# EAGLE design uwbsender (EAGLE 8.6.0)
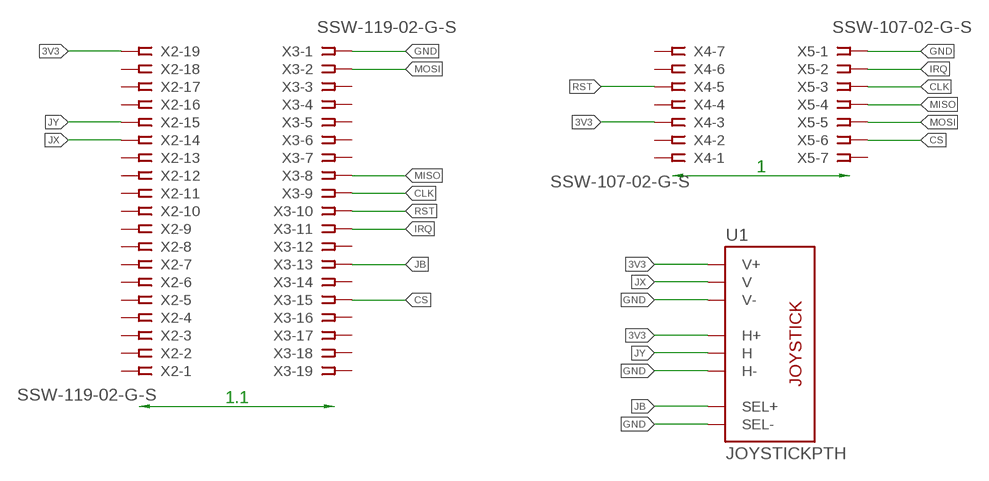
[diagram p0: schematic, sheet 1]

## Parts
U1  JOYSTICKPTH  [JOYSTICK]
X2  SSW-119-02-G-S  [SSW-119-02-G-S]
X3  SSW-119-02-G-S  [SSW-119-02-G-S]
X4  SSW-107-02-G-S  [SSW-107-02-G-S]
X5  SSW-107-02-G-S  [SSW-107-02-G-S]

## Nets
3V3: U1.H1(H+) U1.V1(V+) X2.19 X4.3
CLK: X3.9 X5.3
CS: X3.15 X5.6
GND: U1.B2A(SEL-) U1.H3(H-) U1.V3(V-) X3.1 X5.1
IRQ: X3.11 X5.2
JB: U1.B1A(SEL+) X3.13
JX: U1.V2(V) X2.14
JY: U1.H2(H) X2.15
MISO: X3.8 X5.4
MOSI: X3.2 X5.5
RST: X3.10 X4.5
Unconnected: X2.1 X2.2 X2.3 X2.4 X2.5 X2.6 X2.7 X2.8 X2.9 X2.10 X2.11 X2.12 X2.13 X2.16 X2.17 X2.18 X3.3 X3.4 X3.5 X3.6 X3.7 X3.12 X3.14 X3.16 X3.17 X3.18 X3.19 X4.1 X4.2 X4.4 X4.6 X4.7 X5.7

## Library data of the parts
U1 = adafruit:JOYSTICK: Thumb Joystick Joystick commonly found in PS2 controllers. Two pots and a select switch. Adapted from Sparkfun Library (but for more common 6mm switch sticks)
X2 X3 = con-samtec:SSW-119-02-G-S: THROUGH-HOLE .025" SQ POST SOCKET Source: Samtec SSW.pdf; MF: Samtec Inc.; MPN: SSW-119-02-G-S; OC_FARNELL: unknown; OC_NEWARK: 11P9625
X4 X5 = con-samtec:SSW-107-02-G-S: THROUGH-HOLE .025" SQ POST SOCKET Source: Samtec SSW.pdf; MF: Samtec Inc.; MPN: SSW-107-02-G-S; OC_FARNELL: unknown; OC_NEWARK: 11P9433

## Board
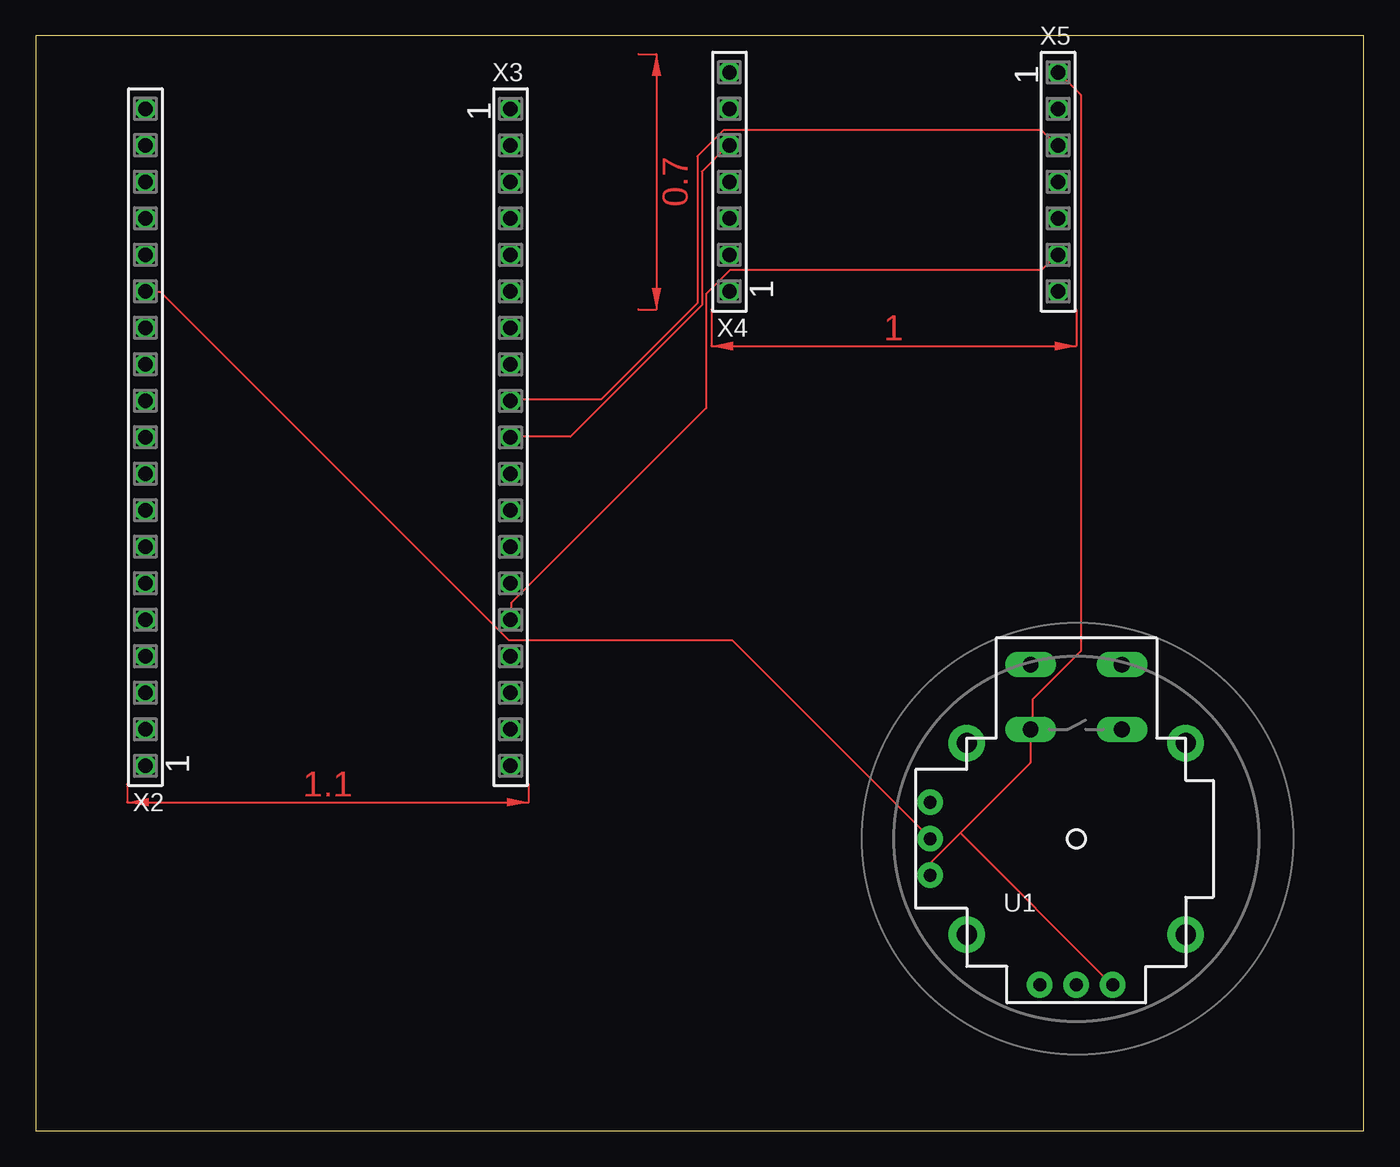
[diagram p1: board, top side]
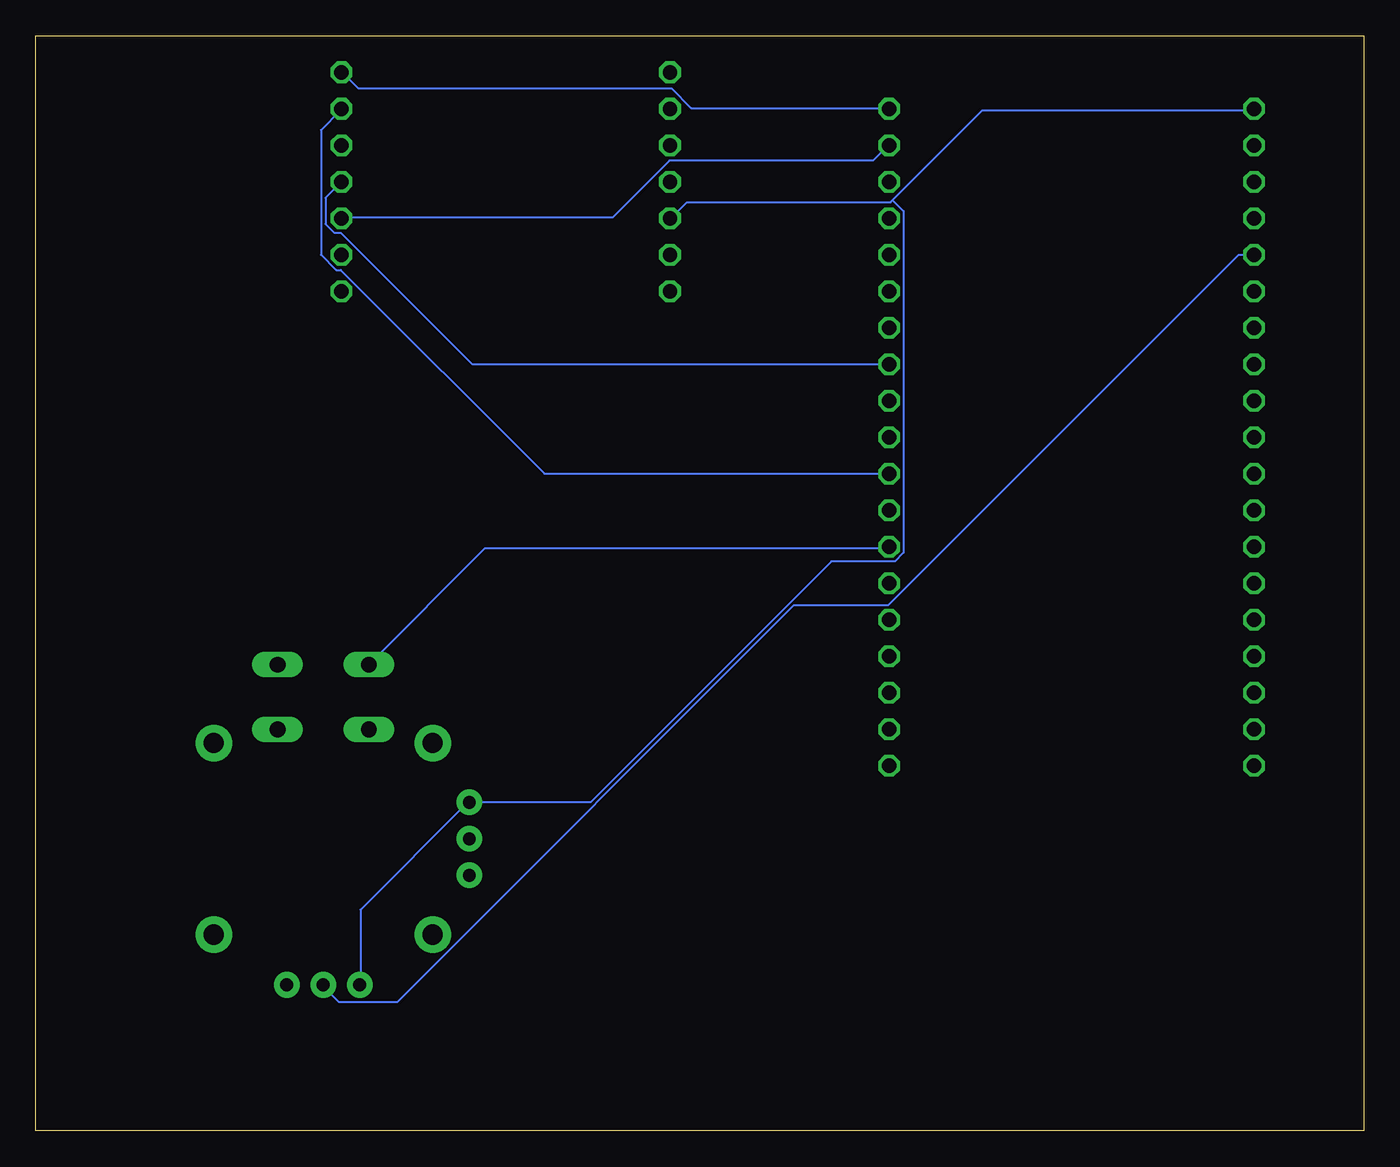
[diagram p2: board, bottom side, seen from below]

Size 92.38 x 76.19 mm. Coordinates in mm from the lower left corner, seen from the top.
Outline: 0,0 92.38,0 92.38,76.19 0,76.19 0,0
Copper layers (1*16): Top 0.035mm / dielectric 1.5mm / Bottom 0.035mm
Design rules "default": minimum track width 6mil, minimum drill 0.35mm, track to track 6mil, track to pad 6mil, pad to pad 6mil, via to via 6mil, smd to smd 6mil, copper to edge 40mil, drill to drill 6mil, minimum pad ring 10mil, minimum via ring 8mil, stop-mask expansion 4mil, vias tented up to drill 0mil, thermal gap 10mil

### Footprints (pad centres in the part's own frame; a part is rotated, then mirrored left to right if it is on the bottom)
JOYSTICK = drill 1.1 pad 1.778 long: B1A -3.175,12.12; B1B 3.175,12.12; B2A -3.175,7.62; B2B 3.175,7.62 | drill 0.889 pad 1.778: H1 -2.54,-10.16; H2 0,-10.16; H3 2.54,-10.16; V1 -10.16,2.54; V2 -10.16,0; V3 -10.16,-2.54 | drill 1.397 pad 2.54: MOUNT1 -7.62,6.668; MOUNT2 -7.62,-6.668; MOUNT3 7.62,-6.668; MOUNT4 7.62,6.668
SSW-119-02-G-S = drill 1 pad 1.5 octagon: 1 -22.86,0; 2 -20.32,0; 3 -17.78,0; 4 -15.24,0; 5 -12.7,0; 6 -10.16,0; 7 -7.62,0; 8 -5.08,0; 9 -2.54,0; 10 0,0; 11 2.54,0; 12 5.08,0; 13 7.62,0; 14 10.16,0; 15 12.7,0; 16 15.24,0; 17 17.78,0; 18 20.32,0; 19 22.86,0
SSW-107-02-G-S = drill 1 pad 1.5 octagon: 1 -7.62,0; 2 -5.08,0; 3 -2.54,0; 4 0,0; 5 2.54,0; 6 5.08,0; 7 7.62,0

### Placement (x,y rotation side)
U1  72.39,20.32 0 top
X2  7.62,48.26 90 top
X3  33.02,48.26 270 top
X4  48.26,66.04 90 top
X5  71.12,66.04 270 top

### Tracks (layer width: path | path; a pad name or v marks a point on that pad's centre or on a via)
3V3
  Bottom 0.152: U1.H1 69.8,10.21 69.8,15.39 62.33,22.86 U1.V1 53.8,22.86 37.03,39.62 32.61,39.62 32,40.23 32,64.01 32.77,64.77 | 32.77,64.77 32.92,64.62 47.09,64.62 48.16,63.55 X4.3 | 32.77,64.77 26.52,71.02 7.62,71.02 X2.19
CLK
  Top 0.152: X3.9 33.07,50.9 39.32,50.9 46.02,57.61 46.02,67.82 47.85,69.65 69.95,69.65 71.02,68.58 X5.3
CS
  Top 0.152: X3.15 33.07,35.66 33.07,36.73 46.63,50.29 46.63,58.22 48.31,59.89 69.95,59.89 71.02,60.96 X5.6
GND
  Top 0.152: 64.31,20.73 69.19,25.6 69.19,27.89 U1.B2A 69.34,28.04 69.34,30.02 72.69,33.38 72.69,72.08 X5.1 | 64.31,20.73 62.33,18.75 62.33,17.83 U1.V3 | 64.31,20.73 74.83,10.21 U1.H3
  Bottom 0.152: X3.1 33.07,71.17 46.79,71.17 48.16,72.54 69.95,72.54 71.02,73.61 X5.1
IRQ
  Bottom 0.152: X3.11 57,45.72 71.17,59.89 71.48,59.89 72.54,60.96 72.54,69.65 71.17,71.02 X5.2
JB
  Bottom 0.152: X3.13 33.07,40.54 61.11,40.54 69.19,32.46 U1.B1A
JX
  Top 0.152: X2.14 7.62,58.37 8.69,58.37 32.92,34.14 48.46,34.14 62.18,20.42 U1.V2
JY
  Bottom 0.152: X2.15 8.69,60.96 33.07,36.58 39.62,36.58 67.21,8.99 71.32,8.99 72.39,10.06 U1.H2
MISO
  Bottom 0.152: X3.8 62.03,53.34 71.17,62.48 71.63,62.48 72.24,63.09 72.24,64.92 X5.4
MOSI
  Bottom 0.152: X5.5 71.02,63.55 52.27,63.55 48.31,67.51 34.14,67.51 33.07,68.58 X3.2
RST
  Top 0.152: X3.10 33.07,48.31 37.19,48.31 46.33,57.45 46.33,66.75 48.16,68.58 X4.5
(copper drawn outside any net)
  shapes: Top area x3